# EAGLE schematic AutoPad-R2-RevA-Pads (EAGLE 9.6.1), part 2 of 2
## Sheet 7 of 8
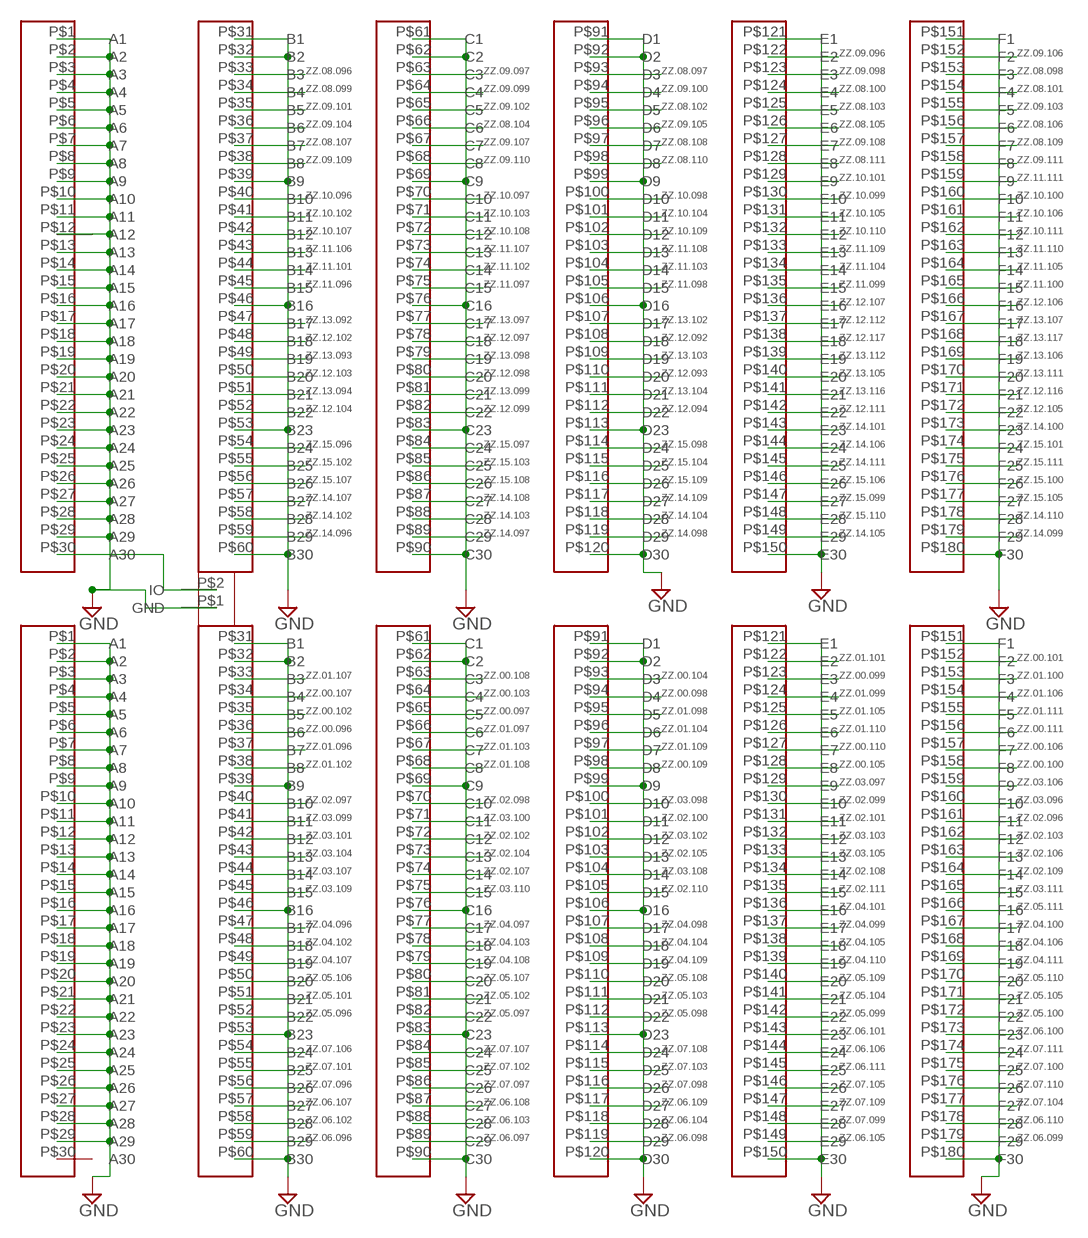
[diagram p6: schematic, sheet 7]

### Parts
U$13  SEAM-30-02.0-L-06-1-A-K-TR  [SEAM-30-02.0-L-06-1-A-K-TR]
U$14  SEAM-30-02.0-L-06-1-A-K-TR  [SEAM-30-02.0-L-06-1-A-K-TR]
U$23  DS2431  [SD2431]

### Nets
GND: U$13.P$1(A1) U$13.P$2(A2) U$13.P$3(A3) U$13.P$4(A4) U$13.P$5(A5) U$13.P$6(A6) U$13.P$7(A7) U$13.P$8(A8) U$13.P$9(A9) U$13.P$10(A10) U$13.P$11(A11) U$13.P$12(A12) U$13.P$13(A13) U$13.P$14(A14) U$13.P$15(A15) U$13.P$16(A16) U$13.P$17(A17) U$13.P$18(A18) U$13.P$19(A19) U$13.P$20(A20) U$13.P$21(A21) U$13.P$22(A22) U$13.P$23(A23) U$13.P$24(A24) U$13.P$25(A25) U$13.P$26(A26) U$13.P$27(A27) U$13.P$28(A28) U$13.P$29(A29) U$13.P$31(B1) U$13.P$32(B2) U$13.P$39(B9) U$13.P$46(B16) U$13.P$53(B23) U$13.P$60(B30) U$13.P$61(C1) U$13.P$62(C2) U$13.P$69(C9) U$13.P$76(C16) U$13.P$83(C23) U$13.P$90(C30) U$13.P$91(D1) U$13.P$92(D2) U$13.P$99(D9) U$13.P$106(D16) U$13.P$113(D23) U$13.P$120(D30) U$13.P$121(E1) U$13.P$150(E30) U$13.P$151(F1) U$13.P$180(F30) U$14.P$1(A1) U$14.P$2(A2) U$14.P$3(A3) U$14.P$4(A4) U$14.P$5(A5) U$14.P$6(A6) U$14.P$7(A7) U$14.P$8(A8) U$14.P$9(A9) U$14.P$10(A10) U$14.P$11(A11) U$14.P$12(A12) U$14.P$13(A13) U$14.P$14(A14) U$14.P$15(A15) U$14.P$16(A16) U$14.P$17(A17) U$14.P$18(A18) U$14.P$19(A19) U$14.P$20(A20) U$14.P$21(A21) U$14.P$22(A22) U$14.P$23(A23) U$14.P$24(A24) U$14.P$25(A25) U$14.P$26(A26) U$14.P$27(A27) U$14.P$28(A28) U$14.P$29(A29) U$14.P$31(B1) U$14.P$32(B2) U$14.P$39(B9) U$14.P$46(B16) U$14.P$53(B23) U$14.P$60(B30) U$14.P$61(C1) U$14.P$62(C2) U$14.P$69(C9) U$14.P$76(C16) U$14.P$83(C23) U$14.P$90(C30) U$14.P$91(D1) U$14.P$92(D2) U$14.P$99(D9) U$14.P$106(D16) U$14.P$113(D23) U$14.P$120(D30) U$14.P$121(E1) U$14.P$150(E30) U$14.P$151(F1) U$14.P$180(F30) U$23.P$1(GND) ; also sheet 1,2,3,4,5,6,8
N$6: U$13.P$30(A30) U$23.P$2(IO)
ZZ.00.096: U$14.P$36(B6)
ZZ.00.097: U$14.P$65(C5)
ZZ.00.098: U$14.P$94(D4)
ZZ.00.099: U$14.P$123(E3)
ZZ.00.100: U$14.P$158(F8)
ZZ.00.101: U$14.P$152(F2)
ZZ.00.102: U$14.P$35(B5)
ZZ.00.103: U$14.P$64(C4)
ZZ.00.104: U$14.P$93(D3)
ZZ.00.105: U$14.P$128(E8)
ZZ.00.106: U$14.P$157(F7)
ZZ.00.107: U$14.P$34(B4)
ZZ.00.108: U$14.P$63(C3)
ZZ.00.109: U$14.P$98(D8)
ZZ.00.110: U$14.P$127(E7)
ZZ.00.111: U$14.P$156(F6)
ZZ.01.096: U$14.P$37(B7)
ZZ.01.097: U$14.P$66(C6)
ZZ.01.098: U$14.P$95(D5)
ZZ.01.099: U$14.P$124(E4)
ZZ.01.100: U$14.P$153(F3)
ZZ.01.101: U$14.P$122(E2)
ZZ.01.102: U$14.P$38(B8)
ZZ.01.103: U$14.P$67(C7)
ZZ.01.104: U$14.P$96(D6)
ZZ.01.105: U$14.P$125(E5)
ZZ.01.106: U$14.P$154(F4)
ZZ.01.107: U$14.P$33(B3)
ZZ.01.108: U$14.P$68(C8)
ZZ.01.109: U$14.P$97(D7)
ZZ.01.110: U$14.P$126(E6)
ZZ.01.111: U$14.P$155(F5)
ZZ.02.096: U$14.P$161(F11)
ZZ.02.097: U$14.P$40(B10)
ZZ.02.098: U$14.P$70(C10)
ZZ.02.099: U$14.P$130(E10)
ZZ.02.100: U$14.P$101(D11)
ZZ.02.101: U$14.P$131(E11)
ZZ.02.102: U$14.P$72(C12)
ZZ.02.103: U$14.P$162(F12)
ZZ.02.104: U$14.P$73(C13)
ZZ.02.105: U$14.P$103(D13)
ZZ.02.106: U$14.P$163(F13)
ZZ.02.107: U$14.P$74(C14)
ZZ.02.108: U$14.P$134(E14)
ZZ.02.109: U$14.P$164(F14)
ZZ.02.110: U$14.P$105(D15)
ZZ.02.111: U$14.P$135(E15)
ZZ.03.096: U$14.P$160(F10)
ZZ.03.097: U$14.P$129(E9)
ZZ.03.098: U$14.P$100(D10)
ZZ.03.099: U$14.P$41(B11)
ZZ.03.100: U$14.P$71(C11)
ZZ.03.101: U$14.P$42(B12)
ZZ.03.102: U$14.P$102(D12)
ZZ.03.103: U$14.P$132(E12)
ZZ.03.104: U$14.P$43(B13)
ZZ.03.105: U$14.P$133(E13)
ZZ.03.106: U$14.P$159(F9)
ZZ.03.107: U$14.P$44(B14)
ZZ.03.108: U$14.P$104(D14)
ZZ.03.109: U$14.P$45(B15)
ZZ.03.110: U$14.P$75(C15)
ZZ.03.111: U$14.P$165(F15)
ZZ.04.096: U$14.P$47(B17)
ZZ.04.097: U$14.P$77(C17)
ZZ.04.098: U$14.P$107(D17)
ZZ.04.099: U$14.P$137(E17)
ZZ.04.100: U$14.P$167(F17)
ZZ.04.101: U$14.P$136(E16)
ZZ.04.102: U$14.P$48(B18)
ZZ.04.103: U$14.P$78(C18)
ZZ.04.104: U$14.P$108(D18)
ZZ.04.105: U$14.P$138(E18)
ZZ.04.106: U$14.P$168(F18)
ZZ.04.107: U$14.P$49(B19)
ZZ.04.108: U$14.P$79(C19)
ZZ.04.109: U$14.P$109(D19)
ZZ.04.110: U$14.P$139(E19)
ZZ.04.111: U$14.P$169(F19)
ZZ.05.096: U$14.P$52(B22)
ZZ.05.097: U$14.P$82(C22)
ZZ.05.098: U$14.P$112(D22)
ZZ.05.099: U$14.P$142(E22)
ZZ.05.100: U$14.P$172(F22)
ZZ.05.101: U$14.P$51(B21)
ZZ.05.102: U$14.P$81(C21)
ZZ.05.103: U$14.P$111(D21)
ZZ.05.104: U$14.P$141(E21)
ZZ.05.105: U$14.P$171(F21)
ZZ.05.106: U$14.P$50(B20)
ZZ.05.107: U$14.P$80(C20)
ZZ.05.108: U$14.P$110(D20)
ZZ.05.109: U$14.P$140(E20)
ZZ.05.110: U$14.P$170(F20)
ZZ.05.111: U$14.P$166(F16)
ZZ.06.096: U$14.P$59(B29)
ZZ.06.097: U$14.P$89(C29)
ZZ.06.098: U$14.P$119(D29)
ZZ.06.099: U$14.P$179(F29)
ZZ.06.100: U$14.P$173(F23)
ZZ.06.101: U$14.P$143(E23)
ZZ.06.102: U$14.P$58(B28)
ZZ.06.103: U$14.P$88(C28)
ZZ.06.104: U$14.P$118(D28)
ZZ.06.105: U$14.P$149(E29)
ZZ.06.106: U$14.P$144(E24)
ZZ.06.107: U$14.P$57(B27)
ZZ.06.108: U$14.P$87(C27)
ZZ.06.109: U$14.P$117(D27)
ZZ.06.110: U$14.P$178(F28)
ZZ.06.111: U$14.P$145(E25)
ZZ.07.096: U$14.P$56(B26)
ZZ.07.097: U$14.P$86(C26)
ZZ.07.098: U$14.P$116(D26)
ZZ.07.099: U$14.P$148(E28)
ZZ.07.100: U$14.P$175(F25)
ZZ.07.101: U$14.P$55(B25)
ZZ.07.102: U$14.P$85(C25)
ZZ.07.103: U$14.P$115(D25)
ZZ.07.104: U$14.P$177(F27)
ZZ.07.105: U$14.P$146(E26)
ZZ.07.106: U$14.P$54(B24)
ZZ.07.107: U$14.P$84(C24)
ZZ.07.108: U$14.P$114(D24)
ZZ.07.109: U$14.P$147(E27)
ZZ.07.110: U$14.P$176(F26)
ZZ.07.111: U$14.P$174(F24)
ZZ.08.096: U$13.P$33(B3)
ZZ.08.097: U$13.P$93(D3)
ZZ.08.098: U$13.P$153(F3)
ZZ.08.099: U$13.P$34(B4)
ZZ.08.100: U$13.P$124(E4)
ZZ.08.101: U$13.P$154(F4)
ZZ.08.102: U$13.P$95(D5)
ZZ.08.103: U$13.P$125(E5)
ZZ.08.104: U$13.P$66(C6)
ZZ.08.105: U$13.P$126(E6)
ZZ.08.106: U$13.P$156(F6)
ZZ.08.107: U$13.P$37(B7)
ZZ.08.108: U$13.P$97(D7)
ZZ.08.109: U$13.P$157(F7)
ZZ.08.110: U$13.P$98(D8)
ZZ.08.111: U$13.P$128(E8)
ZZ.09.096: U$13.P$122(E2)
ZZ.09.097: U$13.P$63(C3)
ZZ.09.098: U$13.P$123(E3)
ZZ.09.099: U$13.P$64(C4)
ZZ.09.100: U$13.P$94(D4)
ZZ.09.101: U$13.P$35(B5)
ZZ.09.102: U$13.P$65(C5)
ZZ.09.103: U$13.P$155(F5)
ZZ.09.104: U$13.P$36(B6)
ZZ.09.105: U$13.P$96(D6)
ZZ.09.106: U$13.P$152(F2)
ZZ.09.107: U$13.P$67(C7)
ZZ.09.108: U$13.P$127(E7)
ZZ.09.109: U$13.P$38(B8)
ZZ.09.110: U$13.P$68(C8)
ZZ.09.111: U$13.P$158(F8)
ZZ.10.096: U$13.P$40(B10)
ZZ.10.097: U$13.P$70(C10)
ZZ.10.098: U$13.P$100(D10)
ZZ.10.099: U$13.P$130(E10)
ZZ.10.100: U$13.P$160(F10)
ZZ.10.101: U$13.P$129(E9)
ZZ.10.102: U$13.P$41(B11)
ZZ.10.103: U$13.P$71(C11)
ZZ.10.104: U$13.P$101(D11)
ZZ.10.105: U$13.P$131(E11)
ZZ.10.106: U$13.P$161(F11)
ZZ.10.107: U$13.P$42(B12)
ZZ.10.108: U$13.P$72(C12)
ZZ.10.109: U$13.P$102(D12)
ZZ.10.110: U$13.P$132(E12)
ZZ.10.111: U$13.P$162(F12)
ZZ.11.096: U$13.P$45(B15)
ZZ.11.097: U$13.P$75(C15)
ZZ.11.098: U$13.P$105(D15)
ZZ.11.099: U$13.P$135(E15)
ZZ.11.100: U$13.P$165(F15)
ZZ.11.101: U$13.P$44(B14)
ZZ.11.102: U$13.P$74(C14)
ZZ.11.103: U$13.P$104(D14)
ZZ.11.104: U$13.P$134(E14)
ZZ.11.105: U$13.P$164(F14)
ZZ.11.106: U$13.P$43(B13)
ZZ.11.107: U$13.P$73(C13)
ZZ.11.108: U$13.P$103(D13)
ZZ.11.109: U$13.P$133(E13)
ZZ.11.110: U$13.P$163(F13)
ZZ.11.111: U$13.P$159(F9)
ZZ.12.092: U$13.P$108(D18)
ZZ.12.093: U$13.P$110(D20)
ZZ.12.094: U$13.P$112(D22)
ZZ.12.097: U$13.P$78(C18)
ZZ.12.098: U$13.P$80(C20)
ZZ.12.099: U$13.P$82(C22)
ZZ.12.102: U$13.P$48(B18)
ZZ.12.103: U$13.P$50(B20)
ZZ.12.104: U$13.P$52(B22)
ZZ.12.105: U$13.P$172(F22)
ZZ.12.106: U$13.P$166(F16)
ZZ.12.107: U$13.P$136(E16)
ZZ.12.111: U$13.P$142(E22)
ZZ.12.112: U$13.P$137(E17)
ZZ.12.116: U$13.P$171(F21)
ZZ.12.117: U$13.P$138(E18)
ZZ.13.092: U$13.P$47(B17)
ZZ.13.093: U$13.P$49(B19)
ZZ.13.094: U$13.P$51(B21)
ZZ.13.097: U$13.P$77(C17)
ZZ.13.098: U$13.P$79(C19)
ZZ.13.099: U$13.P$81(C21)
ZZ.13.102: U$13.P$107(D17)
ZZ.13.103: U$13.P$109(D19)
ZZ.13.104: U$13.P$111(D21)
ZZ.13.105: U$13.P$140(E20)
ZZ.13.106: U$13.P$169(F19)
ZZ.13.107: U$13.P$167(F17)
ZZ.13.111: U$13.P$170(F20)
ZZ.13.112: U$13.P$139(E19)
ZZ.13.116: U$13.P$141(E21)
ZZ.13.117: U$13.P$168(F18)
ZZ.14.096: U$13.P$59(B29)
ZZ.14.097: U$13.P$89(C29)
ZZ.14.098: U$13.P$119(D29)
ZZ.14.099: U$13.P$179(F29)
ZZ.14.100: U$13.P$173(F23)
ZZ.14.101: U$13.P$143(E23)
ZZ.14.102: U$13.P$58(B28)
ZZ.14.103: U$13.P$88(C28)
ZZ.14.104: U$13.P$118(D28)
ZZ.14.105: U$13.P$149(E29)
ZZ.14.106: U$13.P$144(E24)
ZZ.14.107: U$13.P$57(B27)
ZZ.14.108: U$13.P$87(C27)
ZZ.14.109: U$13.P$117(D27)
ZZ.14.110: U$13.P$178(F28)
ZZ.14.111: U$13.P$145(E25)
ZZ.15.096: U$13.P$54(B24)
ZZ.15.097: U$13.P$84(C24)
ZZ.15.098: U$13.P$114(D24)
ZZ.15.099: U$13.P$147(E27)
ZZ.15.100: U$13.P$176(F26)
ZZ.15.101: U$13.P$174(F24)
ZZ.15.102: U$13.P$55(B25)
ZZ.15.103: U$13.P$85(C25)
ZZ.15.104: U$13.P$115(D25)
ZZ.15.105: U$13.P$177(F27)
ZZ.15.106: U$13.P$146(E26)
ZZ.15.107: U$13.P$56(B26)
ZZ.15.108: U$13.P$86(C26)
ZZ.15.109: U$13.P$116(D26)
ZZ.15.110: U$13.P$148(E28)
ZZ.15.111: U$13.P$175(F25)
Unconnected: U$14.P$30(A30)

## Sheet 8 of 8
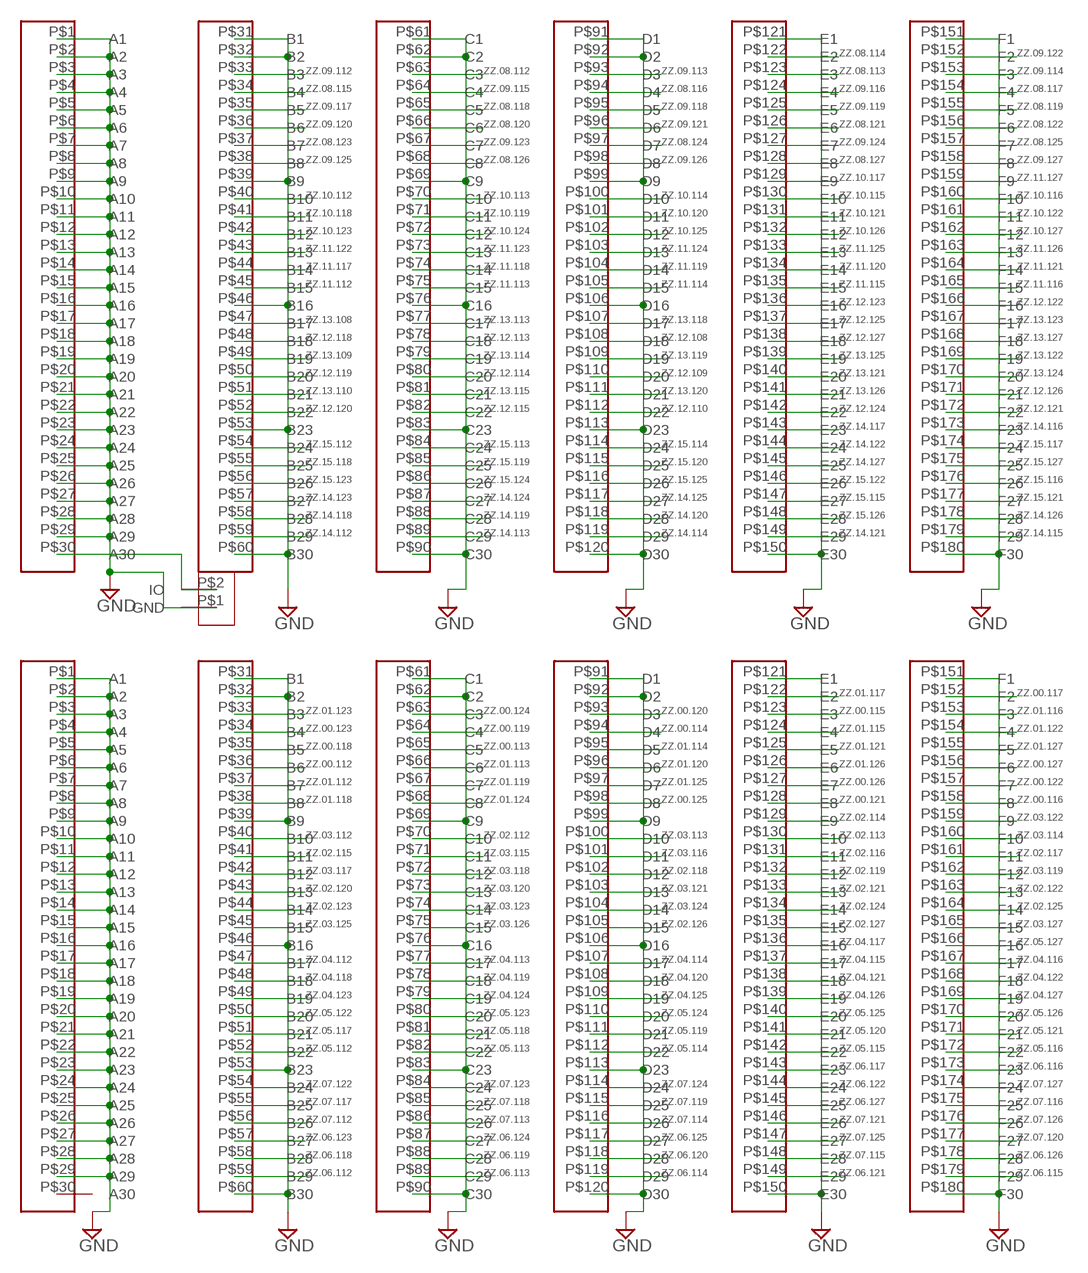
[diagram p7: schematic, sheet 8]

### Parts
U$15  SEAM-30-02.0-L-06-1-A-K-TR  [SEAM-30-02.0-L-06-1-A-K-TR]
U$16  SEAM-30-02.0-L-06-1-A-K-TR  [SEAM-30-02.0-L-06-1-A-K-TR]
U$24  DS2431  [SD2431]

### Nets
GND: U$15.P$1(A1) U$15.P$2(A2) U$15.P$3(A3) U$15.P$4(A4) U$15.P$5(A5) U$15.P$6(A6) U$15.P$7(A7) U$15.P$8(A8) U$15.P$9(A9) U$15.P$10(A10) U$15.P$11(A11) U$15.P$12(A12) U$15.P$13(A13) U$15.P$14(A14) U$15.P$15(A15) U$15.P$16(A16) U$15.P$17(A17) U$15.P$18(A18) U$15.P$19(A19) U$15.P$20(A20) U$15.P$21(A21) U$15.P$22(A22) U$15.P$23(A23) U$15.P$24(A24) U$15.P$25(A25) U$15.P$26(A26) U$15.P$27(A27) U$15.P$28(A28) U$15.P$29(A29) U$15.P$31(B1) U$15.P$32(B2) U$15.P$39(B9) U$15.P$46(B16) U$15.P$53(B23) U$15.P$60(B30) U$15.P$61(C1) U$15.P$62(C2) U$15.P$69(C9) U$15.P$76(C16) U$15.P$83(C23) U$15.P$90(C30) U$15.P$91(D1) U$15.P$92(D2) U$15.P$99(D9) U$15.P$106(D16) U$15.P$113(D23) U$15.P$120(D30) U$15.P$121(E1) U$15.P$150(E30) U$15.P$151(F1) U$15.P$180(F30) U$16.P$1(A1) U$16.P$2(A2) U$16.P$3(A3) U$16.P$4(A4) U$16.P$5(A5) U$16.P$6(A6) U$16.P$7(A7) U$16.P$8(A8) U$16.P$9(A9) U$16.P$10(A10) U$16.P$11(A11) U$16.P$12(A12) U$16.P$13(A13) U$16.P$14(A14) U$16.P$15(A15) U$16.P$16(A16) U$16.P$17(A17) U$16.P$18(A18) U$16.P$19(A19) U$16.P$20(A20) U$16.P$21(A21) U$16.P$22(A22) U$16.P$23(A23) U$16.P$24(A24) U$16.P$25(A25) U$16.P$26(A26) U$16.P$27(A27) U$16.P$28(A28) U$16.P$29(A29) U$16.P$31(B1) U$16.P$32(B2) U$16.P$39(B9) U$16.P$46(B16) U$16.P$53(B23) U$16.P$60(B30) U$16.P$61(C1) U$16.P$62(C2) U$16.P$69(C9) U$16.P$76(C16) U$16.P$83(C23) U$16.P$90(C30) U$16.P$91(D1) U$16.P$92(D2) U$16.P$99(D9) U$16.P$106(D16) U$16.P$113(D23) U$16.P$120(D30) U$16.P$121(E1) U$16.P$150(E30) U$16.P$151(F1) U$16.P$180(F30) U$24.P$1(GND) ; also sheet 1,2,3,4,5,6,7
N$7: U$15.P$30(A30) U$24.P$2(IO)
ZZ.00.112: U$16.P$36(B6)
ZZ.00.113: U$16.P$65(C5)
ZZ.00.114: U$16.P$94(D4)
ZZ.00.115: U$16.P$123(E3)
ZZ.00.116: U$16.P$158(F8)
ZZ.00.117: U$16.P$152(F2)
ZZ.00.118: U$16.P$35(B5)
ZZ.00.119: U$16.P$64(C4)
ZZ.00.120: U$16.P$93(D3)
ZZ.00.121: U$16.P$128(E8)
ZZ.00.122: U$16.P$157(F7)
ZZ.00.123: U$16.P$34(B4)
ZZ.00.124: U$16.P$63(C3)
ZZ.00.125: U$16.P$98(D8)
ZZ.00.126: U$16.P$127(E7)
ZZ.00.127: U$16.P$156(F6)
ZZ.01.112: U$16.P$37(B7)
ZZ.01.113: U$16.P$66(C6)
ZZ.01.114: U$16.P$95(D5)
ZZ.01.115: U$16.P$124(E4)
ZZ.01.116: U$16.P$153(F3)
ZZ.01.117: U$16.P$122(E2)
ZZ.01.118: U$16.P$38(B8)
ZZ.01.119: U$16.P$67(C7)
ZZ.01.120: U$16.P$96(D6)
ZZ.01.121: U$16.P$125(E5)
ZZ.01.122: U$16.P$154(F4)
ZZ.01.123: U$16.P$33(B3)
ZZ.01.124: U$16.P$68(C8)
ZZ.01.125: U$16.P$97(D7)
ZZ.01.126: U$16.P$126(E6)
ZZ.01.127: U$16.P$155(F5)
ZZ.02.112: U$16.P$70(C10)
ZZ.02.113: U$16.P$130(E10)
ZZ.02.114: U$16.P$129(E9)
ZZ.02.115: U$16.P$41(B11)
ZZ.02.116: U$16.P$131(E11)
ZZ.02.117: U$16.P$161(F11)
ZZ.02.118: U$16.P$102(D12)
ZZ.02.119: U$16.P$132(E12)
ZZ.02.120: U$16.P$43(B13)
ZZ.02.121: U$16.P$133(E13)
ZZ.02.122: U$16.P$163(F13)
ZZ.02.123: U$16.P$44(B14)
ZZ.02.124: U$16.P$134(E14)
ZZ.02.125: U$16.P$164(F14)
ZZ.02.126: U$16.P$105(D15)
ZZ.02.127: U$16.P$135(E15)
ZZ.03.112: U$16.P$40(B10)
ZZ.03.113: U$16.P$100(D10)
ZZ.03.114: U$16.P$160(F10)
ZZ.03.115: U$16.P$71(C11)
ZZ.03.116: U$16.P$101(D11)
ZZ.03.117: U$16.P$42(B12)
ZZ.03.118: U$16.P$72(C12)
ZZ.03.119: U$16.P$162(F12)
ZZ.03.120: U$16.P$73(C13)
ZZ.03.121: U$16.P$103(D13)
ZZ.03.122: U$16.P$159(F9)
ZZ.03.123: U$16.P$74(C14)
ZZ.03.124: U$16.P$104(D14)
ZZ.03.125: U$16.P$45(B15)
ZZ.03.126: U$16.P$75(C15)
ZZ.03.127: U$16.P$165(F15)
ZZ.04.112: U$16.P$47(B17)
ZZ.04.113: U$16.P$77(C17)
ZZ.04.114: U$16.P$107(D17)
ZZ.04.115: U$16.P$137(E17)
ZZ.04.116: U$16.P$167(F17)
ZZ.04.117: U$16.P$136(E16)
ZZ.04.118: U$16.P$48(B18)
ZZ.04.119: U$16.P$78(C18)
ZZ.04.120: U$16.P$108(D18)
ZZ.04.121: U$16.P$138(E18)
ZZ.04.122: U$16.P$168(F18)
ZZ.04.123: U$16.P$49(B19)
ZZ.04.124: U$16.P$79(C19)
ZZ.04.125: U$16.P$109(D19)
ZZ.04.126: U$16.P$139(E19)
ZZ.04.127: U$16.P$169(F19)
ZZ.05.112: U$16.P$52(B22)
ZZ.05.113: U$16.P$82(C22)
ZZ.05.114: U$16.P$112(D22)
ZZ.05.115: U$16.P$142(E22)
ZZ.05.116: U$16.P$172(F22)
ZZ.05.117: U$16.P$51(B21)
ZZ.05.118: U$16.P$81(C21)
ZZ.05.119: U$16.P$111(D21)
ZZ.05.120: U$16.P$141(E21)
ZZ.05.121: U$16.P$171(F21)
ZZ.05.122: U$16.P$50(B20)
ZZ.05.123: U$16.P$80(C20)
ZZ.05.124: U$16.P$110(D20)
ZZ.05.125: U$16.P$140(E20)
ZZ.05.126: U$16.P$170(F20)
ZZ.05.127: U$16.P$166(F16)
ZZ.06.112: U$16.P$59(B29)
ZZ.06.113: U$16.P$89(C29)
ZZ.06.114: U$16.P$119(D29)
ZZ.06.115: U$16.P$179(F29)
ZZ.06.116: U$16.P$173(F23)
ZZ.06.117: U$16.P$143(E23)
ZZ.06.118: U$16.P$58(B28)
ZZ.06.119: U$16.P$88(C28)
ZZ.06.120: U$16.P$118(D28)
ZZ.06.121: U$16.P$149(E29)
ZZ.06.122: U$16.P$144(E24)
ZZ.06.123: U$16.P$57(B27)
ZZ.06.124: U$16.P$87(C27)
ZZ.06.125: U$16.P$117(D27)
ZZ.06.126: U$16.P$178(F28)
ZZ.06.127: U$16.P$145(E25)
ZZ.07.112: U$16.P$56(B26)
ZZ.07.113: U$16.P$86(C26)
ZZ.07.114: U$16.P$116(D26)
ZZ.07.115: U$16.P$148(E28)
ZZ.07.116: U$16.P$175(F25)
ZZ.07.117: U$16.P$55(B25)
ZZ.07.118: U$16.P$85(C25)
ZZ.07.119: U$16.P$115(D25)
ZZ.07.120: U$16.P$177(F27)
ZZ.07.121: U$16.P$146(E26)
ZZ.07.122: U$16.P$54(B24)
ZZ.07.123: U$16.P$84(C24)
ZZ.07.124: U$16.P$114(D24)
ZZ.07.125: U$16.P$147(E27)
ZZ.07.126: U$16.P$176(F26)
ZZ.07.127: U$16.P$174(F24)
ZZ.08.112: U$15.P$63(C3)
ZZ.08.113: U$15.P$123(E3)
ZZ.08.114: U$15.P$122(E2)
ZZ.08.115: U$15.P$34(B4)
ZZ.08.116: U$15.P$94(D4)
ZZ.08.117: U$15.P$154(F4)
ZZ.08.118: U$15.P$65(C5)
ZZ.08.119: U$15.P$155(F5)
ZZ.08.120: U$15.P$66(C6)
ZZ.08.121: U$15.P$126(E6)
ZZ.08.122: U$15.P$156(F6)
ZZ.08.123: U$15.P$37(B7)
ZZ.08.124: U$15.P$97(D7)
ZZ.08.125: U$15.P$157(F7)
ZZ.08.126: U$15.P$68(C8)
ZZ.08.127: U$15.P$128(E8)
ZZ.09.112: U$15.P$33(B3)
ZZ.09.113: U$15.P$93(D3)
ZZ.09.114: U$15.P$153(F3)
ZZ.09.115: U$15.P$64(C4)
ZZ.09.116: U$15.P$124(E4)
ZZ.09.117: U$15.P$35(B5)
ZZ.09.118: U$15.P$95(D5)
ZZ.09.119: U$15.P$125(E5)
ZZ.09.120: U$15.P$36(B6)
ZZ.09.121: U$15.P$96(D6)
ZZ.09.122: U$15.P$152(F2)
ZZ.09.123: U$15.P$67(C7)
ZZ.09.124: U$15.P$127(E7)
ZZ.09.125: U$15.P$38(B8)
ZZ.09.126: U$15.P$98(D8)
ZZ.09.127: U$15.P$158(F8)
ZZ.10.112: U$15.P$40(B10)
ZZ.10.113: U$15.P$70(C10)
ZZ.10.114: U$15.P$100(D10)
ZZ.10.115: U$15.P$130(E10)
ZZ.10.116: U$15.P$160(F10)
ZZ.10.117: U$15.P$129(E9)
ZZ.10.118: U$15.P$41(B11)
ZZ.10.119: U$15.P$71(C11)
ZZ.10.120: U$15.P$101(D11)
ZZ.10.121: U$15.P$131(E11)
ZZ.10.122: U$15.P$161(F11)
ZZ.10.123: U$15.P$42(B12)
ZZ.10.124: U$15.P$72(C12)
ZZ.10.125: U$15.P$102(D12)
ZZ.10.126: U$15.P$132(E12)
ZZ.10.127: U$15.P$162(F12)
ZZ.11.112: U$15.P$45(B15)
ZZ.11.113: U$15.P$75(C15)
ZZ.11.114: U$15.P$105(D15)
ZZ.11.115: U$15.P$135(E15)
ZZ.11.116: U$15.P$165(F15)
ZZ.11.117: U$15.P$44(B14)
ZZ.11.118: U$15.P$74(C14)
ZZ.11.119: U$15.P$104(D14)
ZZ.11.120: U$15.P$134(E14)
ZZ.11.121: U$15.P$164(F14)
ZZ.11.122: U$15.P$43(B13)
ZZ.11.123: U$15.P$73(C13)
ZZ.11.124: U$15.P$103(D13)
ZZ.11.125: U$15.P$133(E13)
ZZ.11.126: U$15.P$163(F13)
ZZ.11.127: U$15.P$159(F9)
ZZ.12.108: U$15.P$108(D18)
ZZ.12.109: U$15.P$110(D20)
ZZ.12.110: U$15.P$112(D22)
ZZ.12.113: U$15.P$78(C18)
ZZ.12.114: U$15.P$80(C20)
ZZ.12.115: U$15.P$82(C22)
ZZ.12.118: U$15.P$48(B18)
ZZ.12.119: U$15.P$50(B20)
ZZ.12.120: U$15.P$52(B22)
ZZ.12.121: U$15.P$172(F22)
ZZ.12.122: U$15.P$166(F16)
ZZ.12.123: U$15.P$136(E16)
ZZ.12.124: U$15.P$142(E22)
ZZ.12.125: U$15.P$137(E17)
ZZ.12.126: U$15.P$171(F21)
ZZ.12.127: U$15.P$138(E18)
ZZ.13.108: U$15.P$47(B17)
ZZ.13.109: U$15.P$49(B19)
ZZ.13.110: U$15.P$51(B21)
ZZ.13.113: U$15.P$77(C17)
ZZ.13.114: U$15.P$79(C19)
ZZ.13.115: U$15.P$81(C21)
ZZ.13.118: U$15.P$107(D17)
ZZ.13.119: U$15.P$109(D19)
ZZ.13.120: U$15.P$111(D21)
ZZ.13.121: U$15.P$140(E20)
ZZ.13.122: U$15.P$169(F19)
ZZ.13.123: U$15.P$167(F17)
ZZ.13.124: U$15.P$170(F20)
ZZ.13.125: U$15.P$139(E19)
ZZ.13.126: U$15.P$141(E21)
ZZ.13.127: U$15.P$168(F18)
ZZ.14.112: U$15.P$59(B29)
ZZ.14.113: U$15.P$89(C29)
ZZ.14.114: U$15.P$119(D29)
ZZ.14.115: U$15.P$179(F29)
ZZ.14.116: U$15.P$173(F23)
ZZ.14.117: U$15.P$143(E23)
ZZ.14.118: U$15.P$58(B28)
ZZ.14.119: U$15.P$88(C28)
ZZ.14.120: U$15.P$118(D28)
ZZ.14.121: U$15.P$149(E29)
ZZ.14.122: U$15.P$144(E24)
ZZ.14.123: U$15.P$57(B27)
ZZ.14.124: U$15.P$87(C27)
ZZ.14.125: U$15.P$117(D27)
ZZ.14.126: U$15.P$178(F28)
ZZ.14.127: U$15.P$145(E25)
ZZ.15.112: U$15.P$54(B24)
ZZ.15.113: U$15.P$84(C24)
ZZ.15.114: U$15.P$114(D24)
ZZ.15.115: U$15.P$147(E27)
ZZ.15.116: U$15.P$176(F26)
ZZ.15.117: U$15.P$174(F24)
ZZ.15.118: U$15.P$55(B25)
ZZ.15.119: U$15.P$85(C25)
ZZ.15.120: U$15.P$115(D25)
ZZ.15.121: U$15.P$177(F27)
ZZ.15.122: U$15.P$146(E26)
ZZ.15.123: U$15.P$56(B26)
ZZ.15.124: U$15.P$86(C26)
ZZ.15.125: U$15.P$116(D26)
ZZ.15.126: U$15.P$148(E28)
ZZ.15.127: U$15.P$175(F25)
Unconnected: U$16.P$30(A30)

## Library data of the parts
U$1-U$16 = SEAM-30-02.0-L-06-1-A-K-TR-offset-origin:SEAM-30-02.0-L-06-1-A-K-TR
U$17-U$24 = DS2431-Hemmick:DS2431